# EAGLE design touch-exp (EAGLE 4.16)
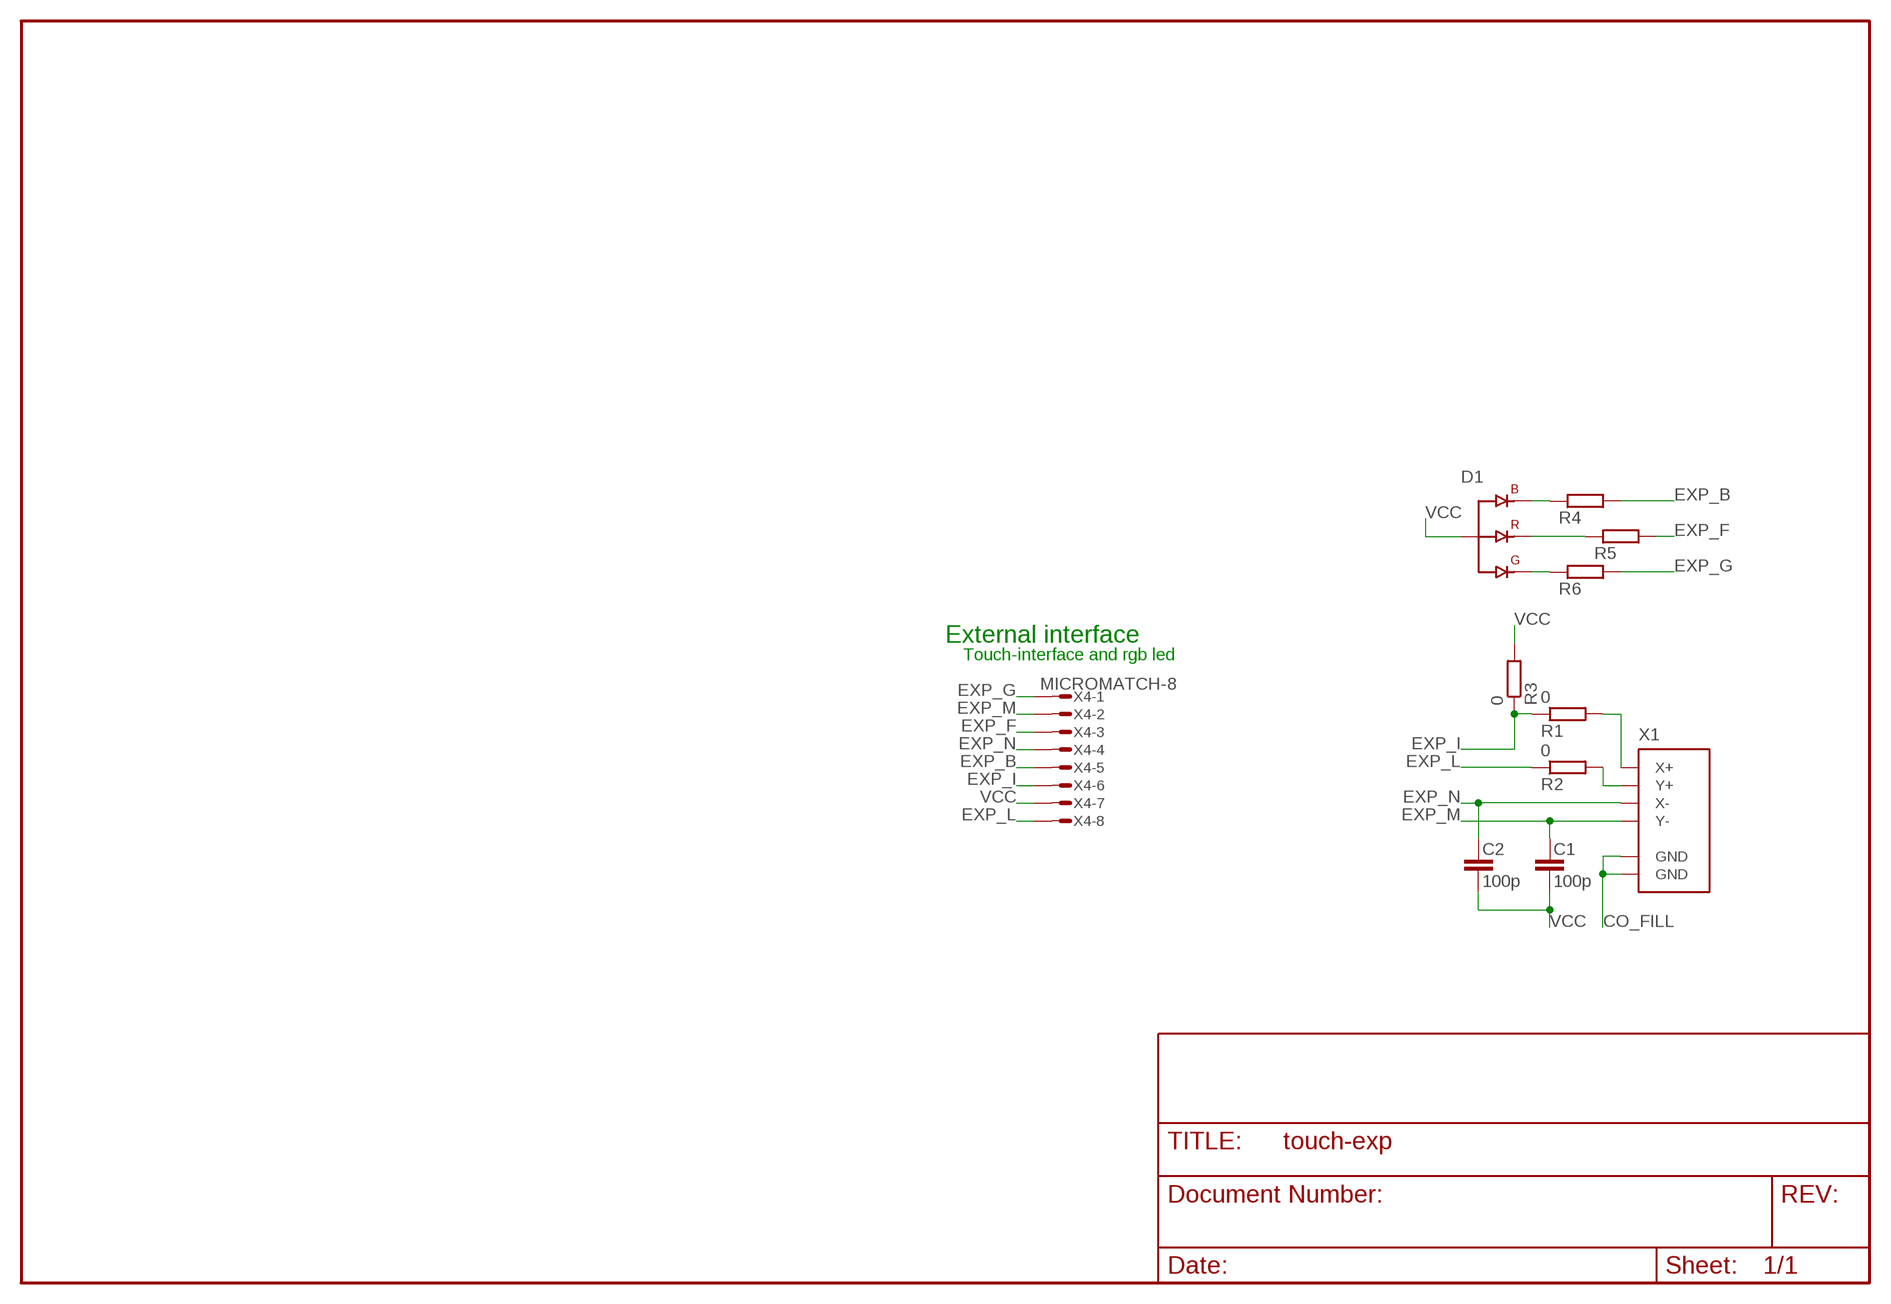
[diagram p0: schematic, sheet 1]

## Parts
C1  100p  C-EUC0603  [C0603]
C2  100p  C-EUC0603  [C0603]
D1  HSMF-C113  [HSMF-C133]
R1  0  R-EUR0603  [R0603]
R2  0  R-EUR0603  [R0603]
R3  0  R-EUR0603  [R0603]
R4  R-EUR0603  [R0603]
R5  R-EUR0603  [R0603]
R6  R-EUR0603  [R0603]
X1  ZIF-XF2U-4SMD  [SMD-4]
X4  MICROMATCH-8  [MICROMATCH-8]

## Nets
B_C: D1.P$1(B_C) R4.1
CO_FILL: X1.CLIP0(GND) X1.CLIP1(GND)
EXP_B: R4.2 X4.5
EXP_F: R5.2 X4.3
EXP_G: R6.2 X4.1
EXP_I: R1.1 R3.1 X4.6
EXP_L: R2.1 X4.8
EXP_M: C1.1 X1.3(Y-) X4.2
EXP_N: C2.1 X1.4(X-) X4.4
G_C: D1.P$4(G_C) R6.1
N$1: R2.2 X1.1(Y+)
N$4: R1.2 X1.2(X+)
R_C: D1.P$3(R_C) R5.1
VCC: C1.2 C2.2 D1.P$2(A) R3.2 X4.7

## Notes on the sheet
- External interface
- Touch-interface and rgb led

## Library data of the parts
C1 C2 = rcl:C-EU
D1 = avago-HSMF-C113:HSMF-C113
R1-R6 = rcl:R-EU
X1 = zif-xf2u:ZIF-XF2U-4
X4 = con-amp-micromatch:MICROMATCH-8: MicroMaTch 8 7-215464-8 / 0-215464-8 Drawing Number C-215464 DDEController.pdf

## Board
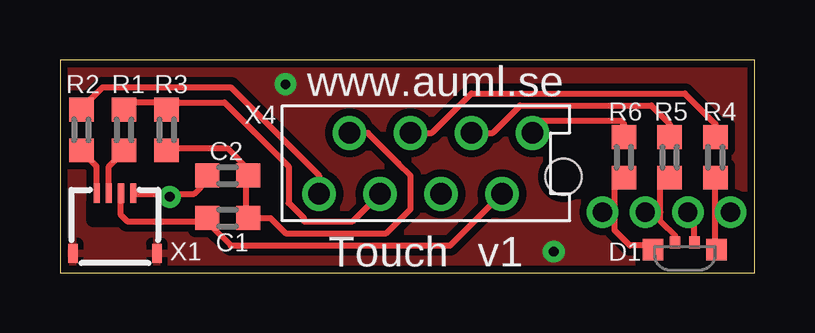
[diagram p1: board, top side]
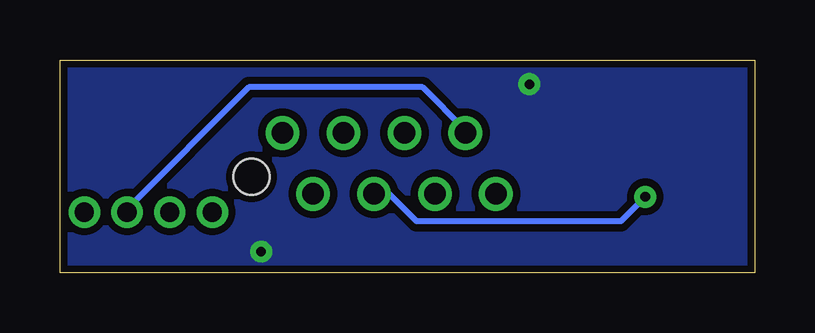
[diagram p2: board, bottom side, seen from below]

Size 28.96 x 8.89 mm. Coordinates in mm from the lower left corner, seen from the top.
Outline: 0,0 28.96,0 28.96,8.89 0,8.89 0,0
Copper layers (1*16): Top 0.035mm / dielectric 1.5mm / Bottom 0.035mm
Design rules "default": minimum track width 10mil, minimum drill 0.4mm, track to track 10mil, track to pad 10mil, pad to pad 10mil, via to via 10mil, smd to smd 8mil, copper to edge 10mil, drill to drill 8mil, minimum pad ring 10mil, minimum via ring 10mil, stop-mask expansion 4mil, vias tented up to drill 0.5mm, thermal gap 10mil

### Footprints (pad centres in the part's own frame; a part is rotated, then mirrored left to right if it is on the bottom)
C0603 = smd 1 x 1: 1 -0.85,0; 2 0.85,0
HSMF-C133 = smd 0.85 x 0.9: P$1 -1.325,0.05; P$4 1.325,0.05 | smd 0.43 x 0.5: P$2 -0.405,-0.25; P$3 0.405,-0.25
R0603 = smd 0.991 x 1.016: 1 -0.85,0; 2 0.85,0
SMD-4 = smd 0.254 x 0.8: 1 -0.762,0.406; 2 -0.254,0.406; 3 0.254,0.406; 4 0.762,0.406 | smd 0.4 x 0.8: CLIP0 -1.75,-2.1; CLIP1 1.75,-2.1
MICROMATCH-8 = drill 0.9 round: 1 4.445,1.27; 2 3.175,-1.27; 3 1.905,1.27; 4 0.635,-1.27; 5 -0.635,1.27; 6 -1.905,-1.27; 7 -3.175,1.27; 8 -4.445,-1.27 | hole 1.5: 5.739,-0.562

### Placement (x,y rotation side)
C1  6.99,2.29 0 top
C2  6.99,4.06 0 top
D1  26.04,1.02 180 top
R1  2.67,5.97 270 top
R2  0.89,5.97 270 top
R3  4.45,5.97 270 top
R4  27.3,4.83 90 top
R5  25.4,4.83 90 top
R6  23.5,4.83 90 top
X1  2.29,2.92 0 top
X4  15.24,4.57 0 top

### Tracks (layer width: path | path; a pad name or v marks a point on that pad's centre or on a via)
B_C  (via drill 0.8)
  Top 0.254: D1.P$1 27.36,1.09 27.3,1.27 27.3,2.54 | 27.3,2.54 R4.1 | 27.3,2.54 v27.94,2.54
CO_FILL  (via drill 0.4)
  other vias: 9.4,7.87 20.57,0.89
  pour Bottom (isolate 0.305, rank 3): 0,8.89 28.96,8.89 28.96,0 0,0
  pour Top (isolate 0.305, rank 3): 0,8.89 28.96,8.89 28.96,0 0,0
EXP_B
  Top 0.254: X4.5 15.49,5.84 17.14,7.49 26.04,7.49 27.3,6.22 R4.2
EXP_F
  Top 0.254: X4.3 18.03,5.84 19.18,6.99 24.64,6.99 25.4,6.22 R5.2
EXP_G
  Top 0.254: X4.1 19.68,6.1 19.94,6.35 23.37,6.35 23.5,6.22 R6.2
EXP_I
  Top 0.254: R1.1 2.79,7.11 4.45,7.11 R3.1 | R3.1 4.45,6.86 | R3.1 4.7,6.86 4.95,7.11 6.86,7.11 9.53,4.45 9.53,2.92 10.16,2.29 10.16,2.16 12.19,2.16 X4.6
EXP_L
  Top 0.254: R2.1 0.89,6.86 1.78,7.75 7.11,7.75 10.79,4.06 X4.8
EXP_M
  Top 0.254: X1.3 2.54,2.41 2.79,2.16 6.1,2.16 6.13,2.2 C1.1 6.22,2.2 6.22,2.03 7.11,1.14 16.26,1.14 X4.2
EXP_N  (via drill 0.4)
  Top 0.254: X1.4 3.05,3.3 4.32,3.3 | 4.32,3.3 v4.57,3.17 | 4.32,3.3 5.59,3.3 6.13,3.85 C2.1
  Bottom 0.254: X4.4 15.24,3.3 14.1,2.16 5.59,2.16 v4.57,3.17
G_C  (via drill 0.8)
  Top 0.254: D1.P$4 24.56,1.09 24.51,1.14 23.75,1.14 23.11,1.78 23.11,2.54 | R6.1 23.5,3.94 23.11,3.56 23.11,2.54 | 23.11,2.54 v22.61,2.54
N$1
  Top 0.254: R2.2 0.89,5.08 1.52,4.45 X1.1
N$4
  Top 0.254: R1.2 2.71,5.12 2.03,4.45 X1.2
R_C  (via drill 0.8)
  Top 0.254: D1.P$3 25.63,1.37 25.65,1.4 25.65,1.52 25.02,2.16 25.02,2.54 | R5.1 25.4,3.94 25.65,3.68 25.15,3.68 25.02,3.56 25.02,2.54 | 25.02,2.54 v24.38,2.54
VCC  (via drill 0.8)
  Top 0.254: X4.7 12.83,5.84 14.1,4.57 14.61,4.06 14.61,2.67 13.59,1.65 9.4,1.65 8.76,2.29 C1.2 7.87,2.29 7.75,2.41 7.75,3.94 7.83,4.03 C2.2 7.83,4.28 7.87,4.32 6.99,5.21 4.7,5.21 4.61,5.12 R3.2 | v26.16,2.54 26.42,2.29 26.42,1.27 D1.P$2
  Bottom 0.254: v26.16,2.54 26.16,2.67 21.08,7.75 13.84,7.75 12.06,5.97 X4.7

### Text on the board
tPlace: www.auml.se | Touch | v1